# EAGLE schematic rc_rx_5V_rotors_only (EAGLE 7.0.0)
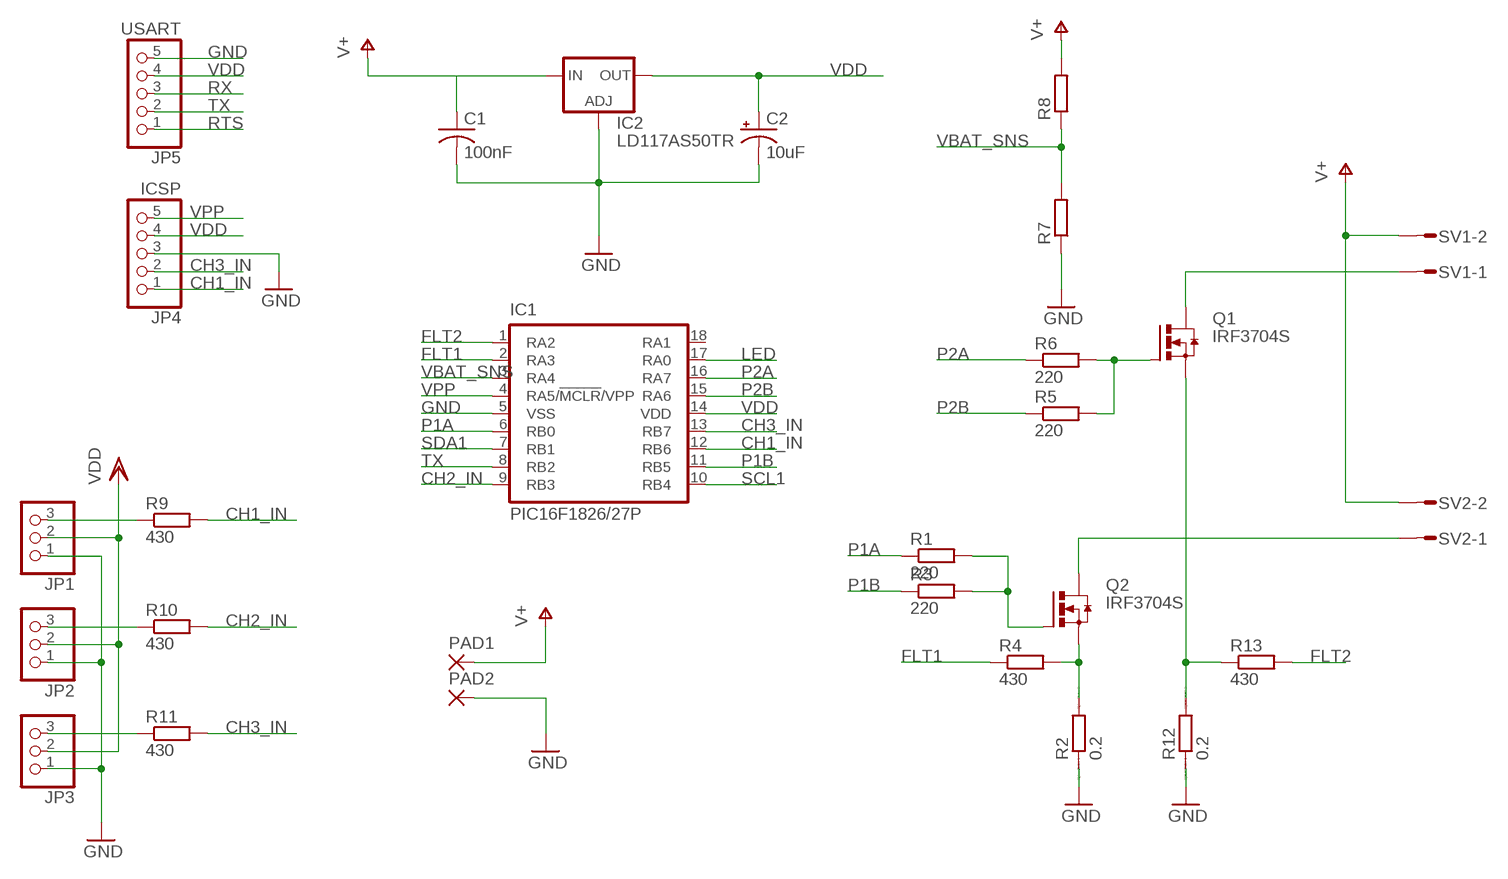
[diagram p0: schematic, sheet 1]

## Parts
C1  100nF  C-US025-025X050  [C025-025X050]
C2  10uF  CPOL-USE3.5-8  [E3,5-8]
IC1  PIC16F1826/27P  [DIL18]
IC2  LD117AS50TR  [SOT223]
JP1  PINHD-1X3  [1X03]
JP2  PINHD-1X3  [1X03]
JP3  PINHD-1X3  [1X03]
JP4  ICSP  PINHD-1X5  [1X05]
JP5  USART  PINHD-1X5  [1X05]
PAD1  3,81/1,4  [3,81/1,4]
PAD2  3,81/1,4  [3,81/1,4]
Q1  IRF3704S  [D2PACK]
Q2  IRF3704S  [D2PACK]
R1  220  R-EU_0204/7  [0204/7]
R2  0.2  RR1210  [R1210]
R3  220  R-EU_0204/7  [0204/7]
R4  430  R-EU_0204/7  [0204/7]
R5  220  R-EU_0204/7  [0204/7]
R6  220  R-EU_0204/7  [0204/7]
R7  R-EU_0204/7  [0204/7]
R8  R-EU_0204/7  [0204/7]
R9  430  R-EU_0204/7  [0204/7]
R10  430  R-EU_0204/7  [0204/7]
R11  430  R-EU_0204/7  [0204/7]
R12  0.2  RR1210  [R1210]
R13  430  R-EU_0204/7  [0204/7]
SV1  S02P  [S02P]
SV2  S02P  [S02P]

## Nets
CH1_IN: IC1.12(RB6) JP4.1 R9.2
CH2_IN: IC1.9(RB3) R10.2
CH3_IN: IC1.13(RB7) JP4.2 R11.2
CRR_SNS: Q1.3(S) R12.2 R13.1
FLT1: IC1.2(RA3) R4.1
FLT2: IC1.1(RA2) R13.2
GND: C1.2 C2.- IC1.5(VSS) IC2.1(ADJ) JP1.1 JP2.1 JP3.1 JP4.3 JP5.5 PAD2.1(P) R2.1 R7.1 R12.1
LED: IC1.17(RA0)
N$1: Q2.1(G) R1.2 R3.2
N$2: Q1.1(G) R5.2 R6.2
N$3: Q2.2(D) SV2.1
N$4: Q1.2(D) SV1.1
N$5: JP1.3 R9.1
N$6: JP2.3 R10.1
N$7: JP3.3 R11.1
N$8: Q2.3(S) R2.2 R4.2
P1A: IC1.6(RB0) R1.1
P1B: IC1.11(RB5) R3.1
P2A: IC1.16(RA7) R6.1
P2B: IC1.15(RA6) R5.1
RTS: JP5.1
RX: JP5.3
SCL1: IC1.10(RB4)
SDA1: IC1.7(RB1)
TX: IC1.8(RB2) JP5.2
V+: C1.1 IC2.3(IN) PAD1.1(P) R8.2 SV1.2 SV2.2
VBAT_SNS: IC1.3(RA4) R7.2 R8.1
VDD: C2.+ IC1.14(VDD) IC2.4(OUT) JP1.2 JP2.2 JP3.2 JP4.4 JP5.4
VPP: IC1.4(RA5/!MCLR!/VPP) JP4.5
Unconnected: IC1.18(RA1)

## Library data of the parts
C1 = rcl:C-US: CAPACITOR, American symbol
C2 = rcl:CPOL-US: POLARIZED CAPACITOR, American symbol
IC1 = microchip:PIC16*F1826/27: 18/20/28-Pin Flash Microcontrollers with nanoWatt XLP Technology Source: www.microchip.com PIC16F1827.pdf
IC2 = v-reg:LD117A?*: Low drop fixed and adjustable positive voltage regulators 1 A Source: http://www.st.com/stonline/products/literature/ds/7194/ld1117axx.pdf
JP1-JP3 = pinhead:PINHD-1X3: PIN HEADER
JP4 JP5 = pinhead:PINHD-1X5: PIN HEADER
PAD1 PAD2 = wirepad:3,81/1,4: THROUGH-HOLE PAD
Q1 Q2 = transistor-power:IRF3704: SMPS MOSFET HEXFET® Power MOSFET Source: http://www.irf.com/product-info/datasheets/data/irf3704.pdf
R1 R3-R11 R13 = resistor:R-EU_: RESISTOR, European symbol
R2 R12 = eagle-ltspice:R: RESISTOR, European symbol; SPICEMODEL: NONE; SPICEPREFIX: R
SV1 SV2 = con-amp-mt:S02P: AMP MT CONNECTOR; OC_FARNELL: unknown; OC_NEWARK: unknown